# EAGLE design Decade Box Relay Board (EAGLE 6.5.0)
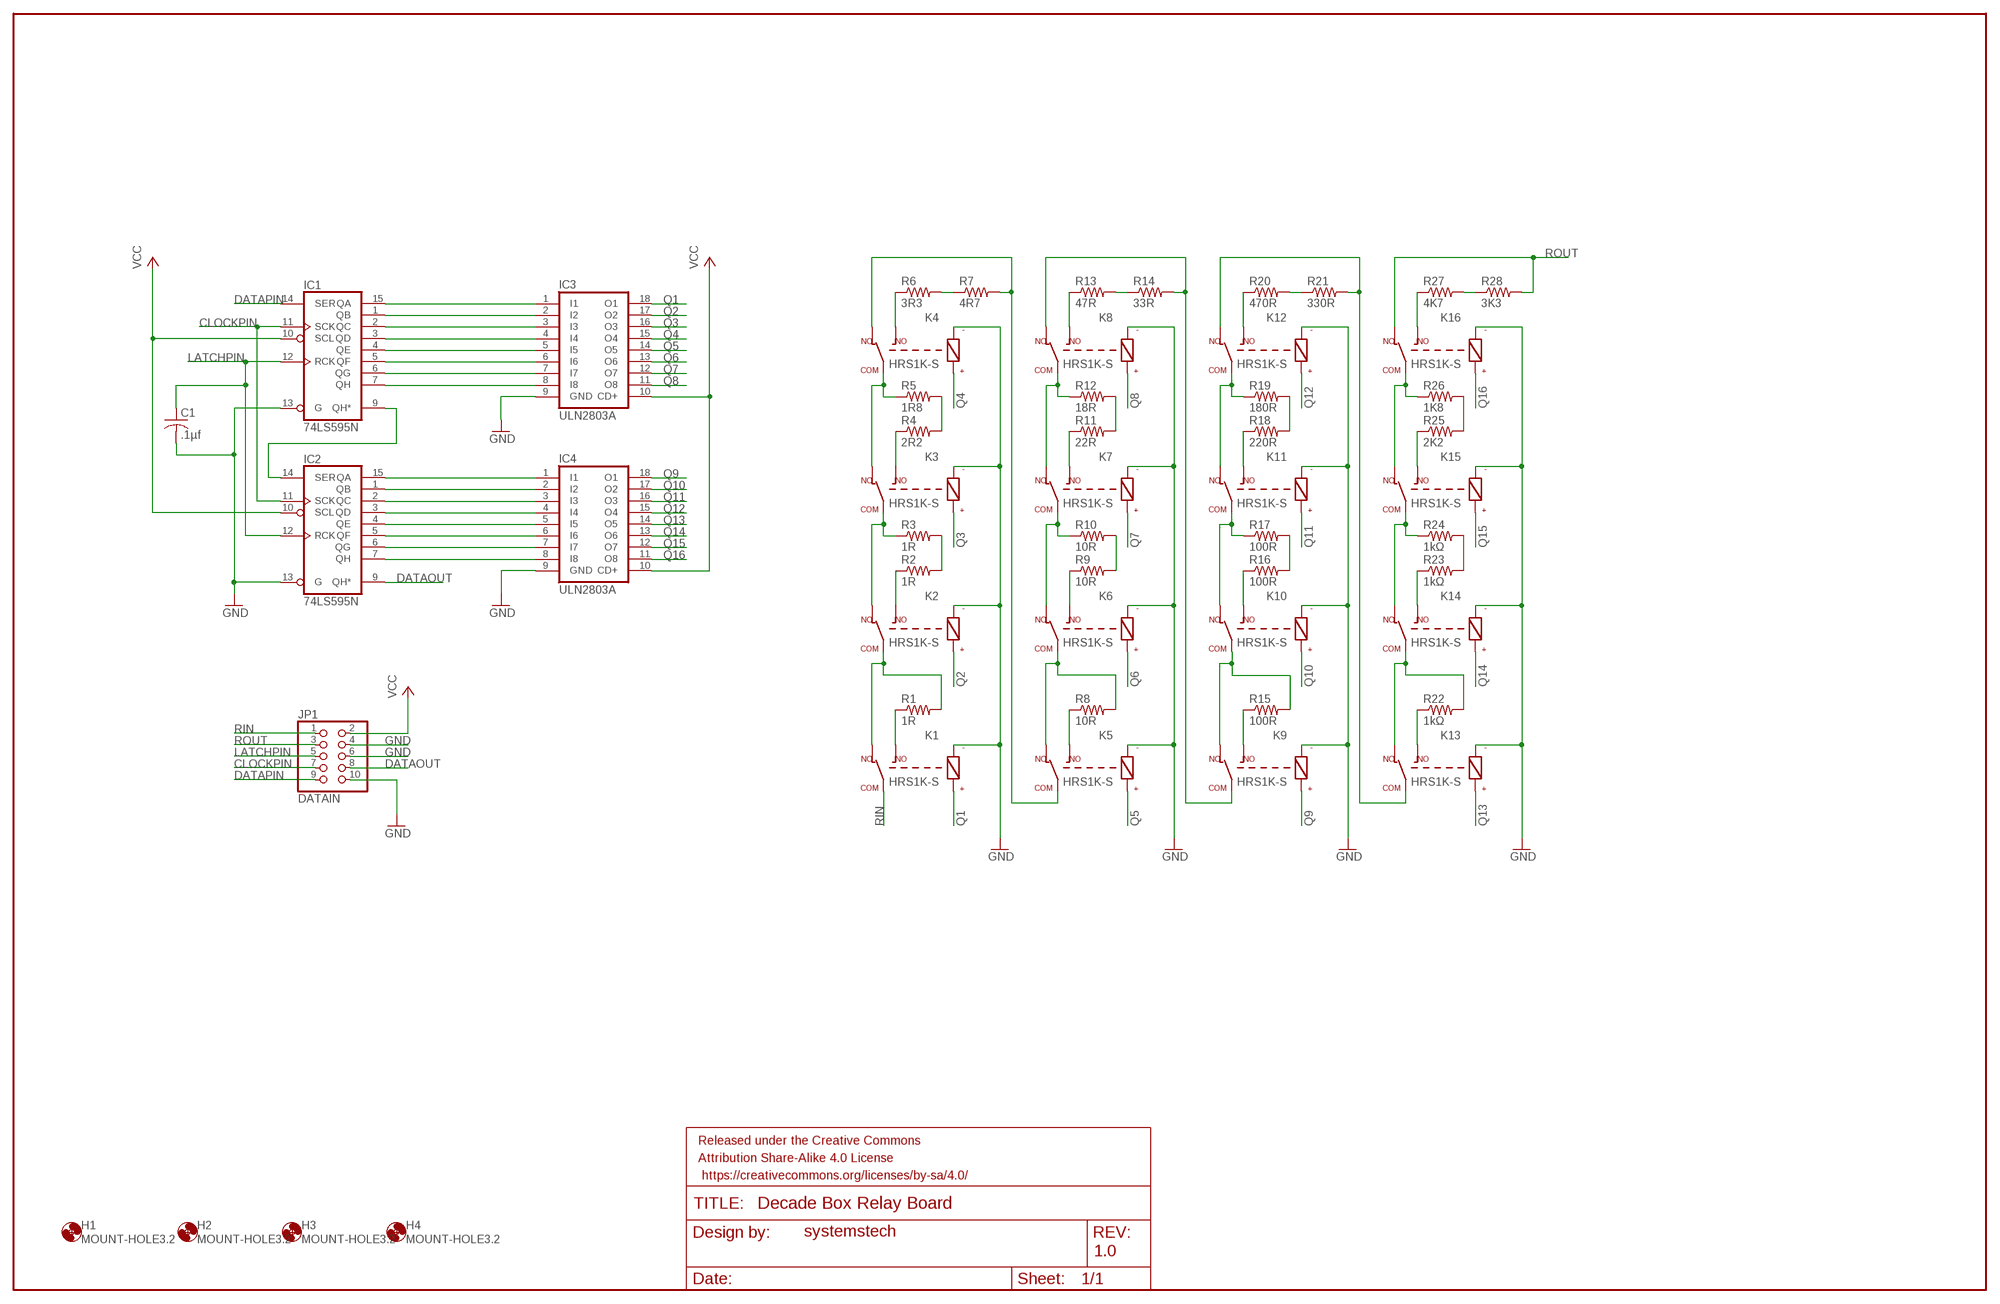
[diagram p0: schematic, sheet 1]

## Parts
C1  .1µf  C-US025-025X050  [C025-025X050]
FRAME1  FRAME-LEDGER  [CREATIVE_COMMONS]
H1  MOUNT-HOLE3.2  [3,2]
H2  MOUNT-HOLE3.2  [3,2]
H3  MOUNT-HOLE3.2  [3,2]
H4  MOUNT-HOLE3.2  [3,2]
IC1  74LS595N  [DIL16]
IC2  74LS595N  [DIL16]
IC3  ULN2803A  [DIL18]
IC4  ULN2803A  [DIL18]
JP1  DATAIN  PINHD-2X5  [2X05]
K1  HRS1K-S  [HRS1K-S]
K2  HRS1K-S  [HRS1K-S]
K3  HRS1K-S  [HRS1K-S]
K4  HRS1K-S  [HRS1K-S]
K5  HRS1K-S  [HRS1K-S]
K6  HRS1K-S  [HRS1K-S]
K7  HRS1K-S  [HRS1K-S]
K8  HRS1K-S  [HRS1K-S]
K9  HRS1K-S  [HRS1K-S]
K10  HRS1K-S  [HRS1K-S]
K11  HRS1K-S  [HRS1K-S]
K12  HRS1K-S  [HRS1K-S]
K13  HRS1K-S  [HRS1K-S]
K14  HRS1K-S  [HRS1K-S]
K15  HRS1K-S  [HRS1K-S]
K16  HRS1K-S  [HRS1K-S]
R1  1R  R-US_0411/15  [0411/15]
R2  1R  R-US_0411/15  [0411/15]
R3  1R  R-US_0411/15  [0411/15]
R4  2R2  R-US_0411/15  [0411/15]
R5  1R8  R-US_0411/15  [0411/15]
R6  3R3  R-US_0411/15  [0411/15]
R7  4R7  R-US_0411/15  [0411/15]
R8  10R  R-US_0411/15  [0411/15]
R9  10R  R-US_0411/15  [0411/15]
R10  10R  R-US_0411/15  [0411/15]
R11  22R  R-US_0411/15  [0411/15]
R12  18R  R-US_0411/15  [0411/15]
R13  47R  R-US_0411/15  [0411/15]
R14  33R  R-US_0411/15  [0411/15]
R15  100R  R-US_0411/15  [0411/15]
R16  100R  R-US_0411/15  [0411/15]
R17  100R  R-US_0411/15  [0411/15]
R18  220R  R-US_0411/15  [0411/15]
R19  180R  R-US_0411/15  [0411/15]
R20  470R  R-US_0411/15  [0411/15]
R21  330R  R-US_0411/15  [0411/15]
R22  1kΩ  R-US_0411/15  [0411/15]
R23  1kΩ  R-US_0411/15  [0411/15]
R24  1kΩ  R-US_0411/15  [0411/15]
R25  2K2  R-US_0411/15  [0411/15]
R26  1K8  R-US_0411/15  [0411/15]
R27  4K7  R-US_0411/15  [0411/15]
R28  3K3  R-US_0411/15  [0411/15]

## Nets
CLOCKPIN: IC1.11(SCK) IC2.11(SCK) JP1.7
DATAOUT: IC2.9(QH*) JP1.8
DATAPIN: IC1.14(SER) JP1.9
GND: C1.2 IC1.13(G) IC2.13(G) IC3.9(GND) IC4.9(GND) JP1.4 JP1.6 JP1.10 K1.P$3 K2.P$3 K3.P$3 K4.P$3 K5.P$3 K6.P$3 K7.P$3 K8.P$3 K9.P$3 K10.P$3 K11.P$3 K12.P$3 K13.P$3 K14.P$3 K15.P$3 K16.P$3
LATCHPIN: C1.1 IC1.12(RCK) IC2.12(RCK) JP1.5
N$1: K12.P$5 K13.P$1 R21.2
N$2: K7.P$4 R11.1
N$3: K15.P$5 K16.P$1 R26.1
N$4: K1.P$5 K2.P$1 R1.2
N$5: K10.P$5 K11.P$1 R17.1
N$6: R9.2 R10.2
N$7: K8.P$5 K9.P$1 R14.2
N$8: K4.P$4 R6.1
N$9: K4.P$5 K5.P$1 R7.2
N$10: R4.2 R5.2
N$11: K1.P$4 R1.1
N$12: IC1.9(QH*) IC2.14(SER)
N$13: K2.P$5 K3.P$1 R3.1
N$14: K2.P$4 R2.1
N$15: K11.P$5 K12.P$1 R19.1
N$16: K3.P$5 K4.P$1 R5.1
N$17: R2.2 R3.2
N$18: R11.2 R12.2
N$19: K5.P$5 K6.P$1 R8.2
N$20: K3.P$4 R4.1
N$21: IC1.15(QA) IC3.1(I1)
N$22: K6.P$5 K7.P$1 R10.1
N$23: R6.2 R7.1
N$24: K9.P$5 K10.P$1 R15.2
N$25: K7.P$5 K8.P$1 R12.1
N$26: K5.P$4 R8.1
N$27: IC1.1(QB) IC3.2(I2)
N$28: K13.P$5 K14.P$1 R22.2
N$29: K6.P$4 R9.1
N$30: K8.P$4 R13.1
N$31: K14.P$5 K15.P$1 R24.1
N$33: IC1.2(QC) IC3.3(I3)
N$34: K9.P$4 R15.1
N$35: IC1.3(QD) IC3.4(I4)
N$36: IC1.4(QE) IC3.5(I5)
N$37: IC1.5(QF) IC3.6(I6)
N$38: IC1.6(QG) IC3.7(I7)
N$39: IC1.7(QH) IC3.8(I8)
N$40: IC2.15(QA) IC4.1(I1)
N$41: IC2.1(QB) IC4.2(I2)
N$42: IC2.2(QC) IC4.3(I3)
N$43: IC2.3(QD) IC4.4(I4)
N$44: IC2.4(QE) IC4.5(I5)
N$45: IC2.5(QF) IC4.6(I6)
N$46: IC2.6(QG) IC4.7(I7)
N$47: IC2.7(QH) IC4.8(I8)
N$53: R13.2 R14.1
N$56: K10.P$4 R16.1
N$57: R16.2 R17.2
N$58: K11.P$4 R18.1
N$59: R18.2 R19.2
N$60: K12.P$4 R20.1
N$61: R20.2 R21.1
N$62: K13.P$4 R22.1
N$64: K14.P$4 R23.1
N$65: R23.2 R24.2
N$66: K15.P$4 R25.1
N$67: R25.2 R26.2
N$68: K16.P$4 R27.1
N$69: R27.2 R28.1
Q1: IC3.18(O1) K1.P$2
Q2: IC3.17(O2) K2.P$2
Q3: IC3.16(O3) K3.P$2
Q4: IC3.15(O4) K4.P$2
Q5: IC3.14(O5) K5.P$2
Q6: IC3.13(O6) K6.P$2
Q7: IC3.12(O7) K7.P$2
Q8: IC3.11(O8) K8.P$2
Q9: IC4.18(O1) K9.P$2
Q10: IC4.17(O2) K10.P$2
Q11: IC4.16(O3) K11.P$2
Q12: IC4.15(O4) K12.P$2
Q13: IC4.14(O5) K13.P$2
Q14: IC4.13(O6) K14.P$2
Q15: IC4.12(O7) K15.P$2
Q16: IC4.11(O8) K16.P$2
RIN: JP1.1 K1.P$1
ROUT: JP1.3 K16.P$5 R28.2
VCC: IC1.10(SCL) IC2.10(SCL) IC3.10(CD+) IC4.10(CD+) JP1.2

## Notes on the sheet
- systemstech
- 1.0

## Power pins joined to a net without a drawn wire
GND: IC1.8(GND) IC2.8(GND)
VCC: IC1.16(VCC) IC2.16(VCC)

## Library data of the parts
C1 = adafruit:C-US: CAPACITOR, American symbol
FRAME1 = SparkFun-Aesthetics:FRAME-LEDGER: Schematic Frame Standard 11x14 US Ledger frame
H1-H4 = holes:MOUNT-HOLE: MOUNTING HOLE with drill center marker
IC1 IC2 = 74xx-us:74*595: 8-bit SHIFT REGISTER, output latch
IC3 IC4 = uln-udn:ULN2803A: DRIVER ARRAY
JP1 = pinhead:PINHD-2X5: PIN HEADER
K1-K16 = railman:HRS1K-S
R1-R28 = adafruit:R-US_: RESISTOR, American symbol

## Board
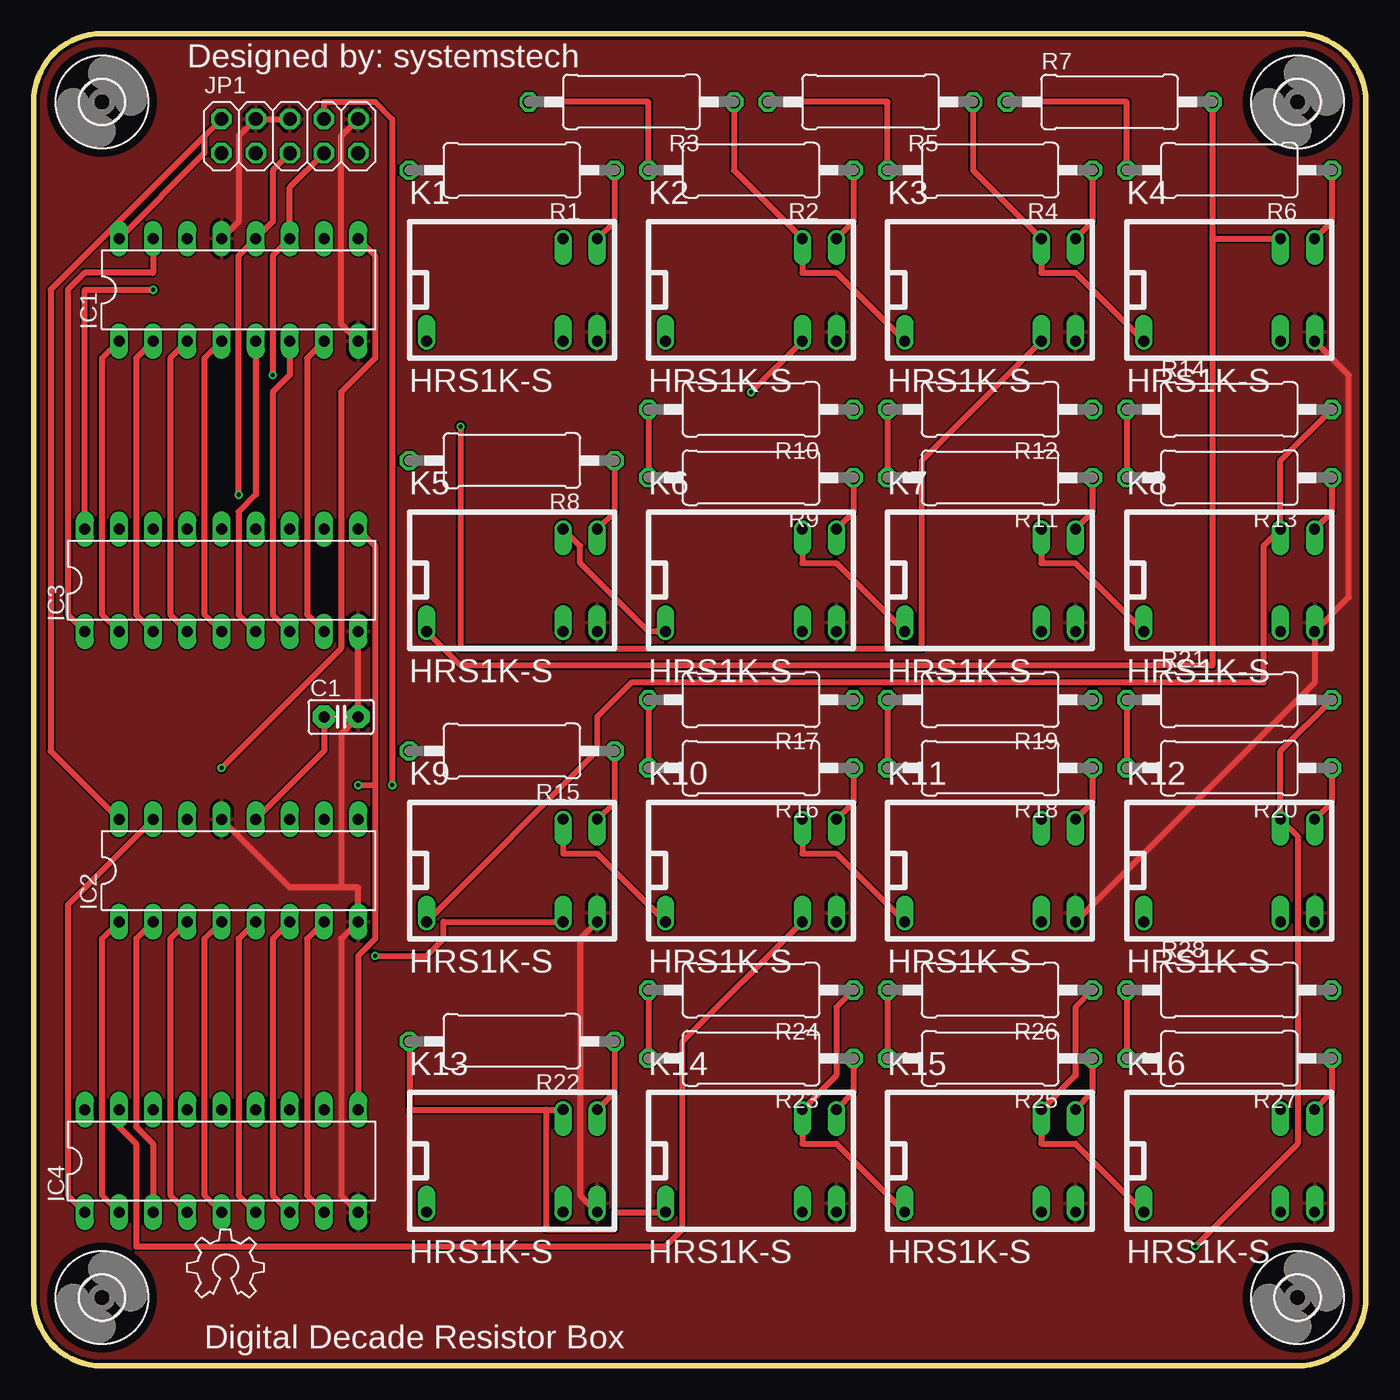
[diagram p1: board, top side]
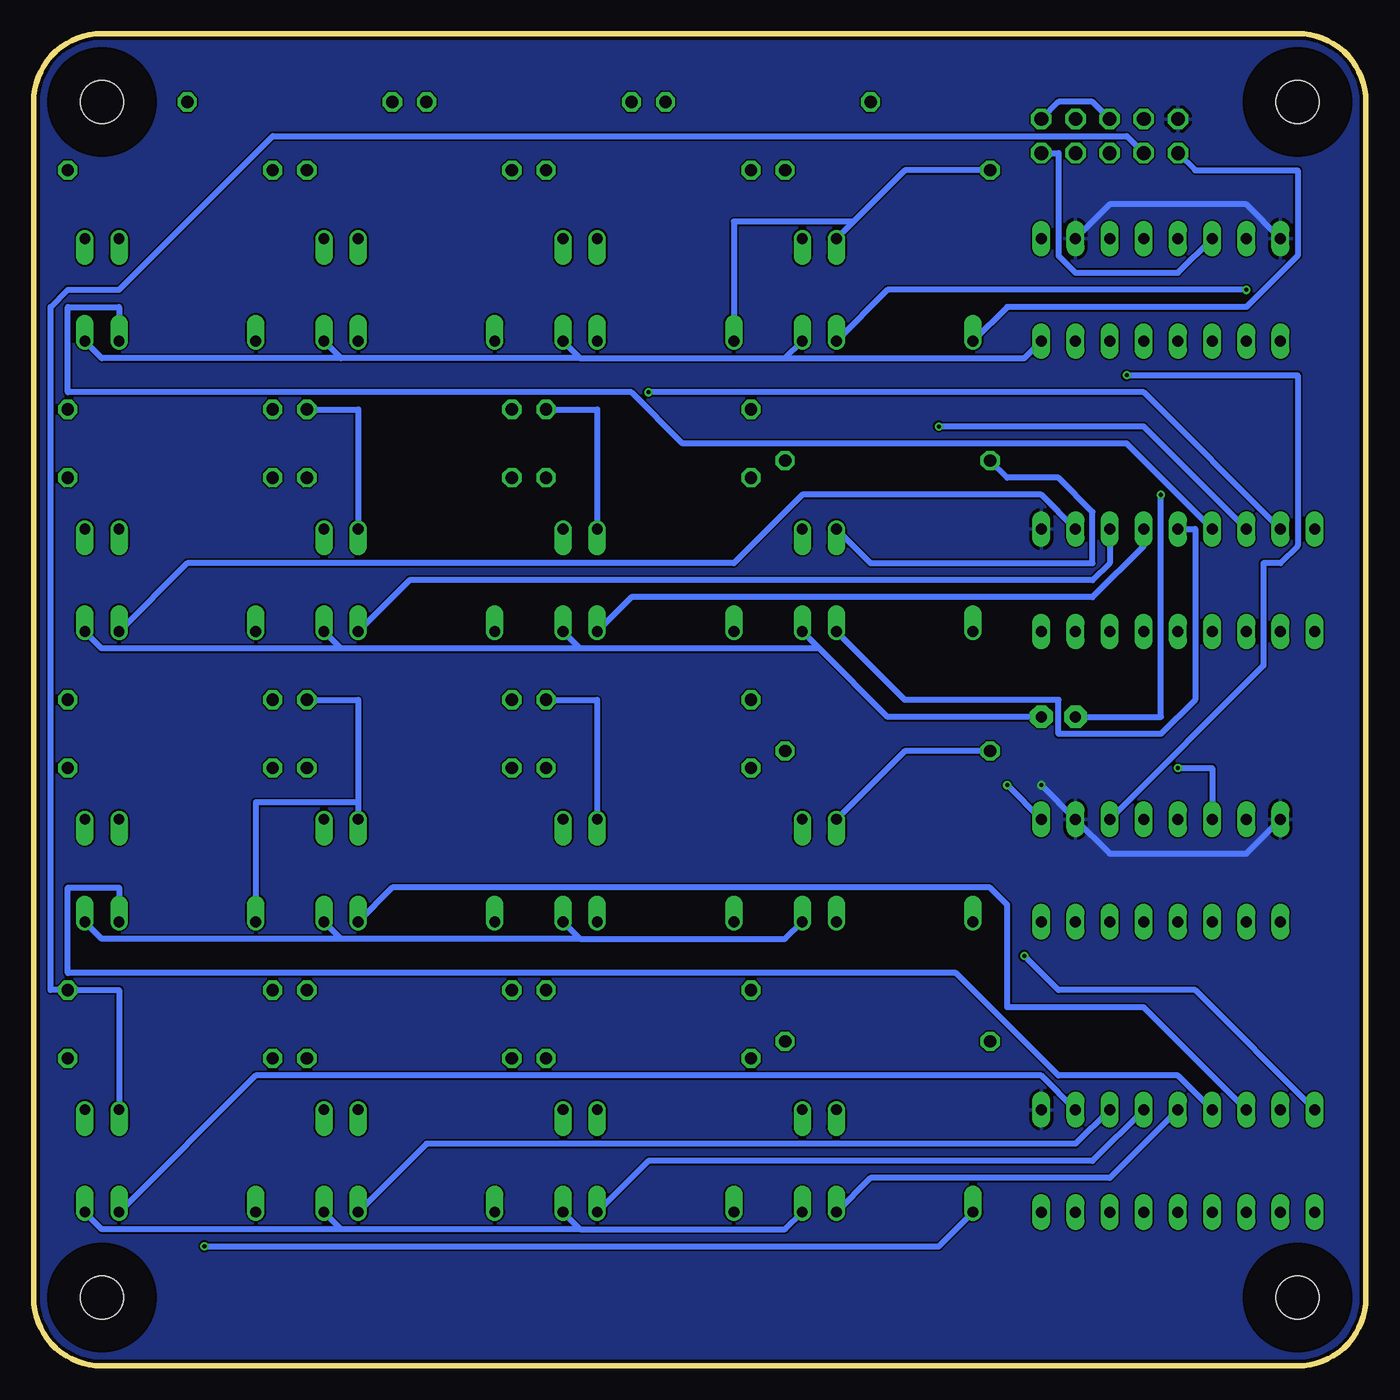
[diagram p2: board, bottom side, seen from below]

Size 99.06 x 99.06 mm. Coordinates in mm from the lower left corner, seen from the top.
Outline: 5.08,0 arc-90 0,5.08 0,93.98 arc-90 5.08,99.06 93.98,99.06 arc-90 99.06,93.98 99.06,5.08 arc-90 93.98,0 5.08,0
Copper layers (1*16): Top 0.035mm / dielectric 1.5mm / Bottom 0.035mm
Design rules "dirt_cheap_dirty_boards.v1 *": minimum track width 18mil, minimum drill 12mil, track to track 5mil, track to pad 5mil, pad to pad 5mil, via to via 5mil, smd to smd 0mil, copper to edge 10mil, drill to drill 10mil, minimum pad ring 10mil, minimum via ring 6mil, stop-mask expansion 2mil, vias tented up to drill 25mil, thermal gap 10mil

### Footprints (pad centres in the part's own frame; a part is rotated, then mirrored left to right if it is on the bottom)
C025-025X050 = drill 0.813 pad 1.676 octagon: 1 -1.27,0; 2 1.27,0
3,2 = hole 3.2: 0,0
DIL16 = drill 0.813 long: 1 -8.89,-3.81; 2 -6.35,-3.81; 3 -3.81,-3.81; 4 -1.27,-3.81; 5 1.27,-3.81; 6 3.81,-3.81; 7 6.35,-3.81; 8 8.89,-3.81; 9 8.89,3.81; 10 6.35,3.81; 11 3.81,3.81; 12 1.27,3.81; 13 -1.27,3.81; 14 -3.81,3.81; 15 -6.35,3.81; 16 -8.89,3.81
DIL18 = drill 0.813 long: 1 -10.16,-3.81; 2 -7.62,-3.81; 3 -5.08,-3.81; 4 -2.54,-3.81; 5 0,-3.81; 6 2.54,-3.81; 7 5.08,-3.81; 8 7.62,-3.81; 9 10.16,-3.81; 10 10.16,3.81; 11 7.62,3.81; 12 5.08,3.81; 13 2.54,3.81; 14 0,3.81; 15 -2.54,3.81; 16 -5.08,3.81; 17 -7.62,3.81; 18 -10.16,3.81
2X05 = drill 1.016 octagon: 1 -5.08,-1.27; 2 -5.08,1.27; 3 -2.54,-1.27; 4 -2.54,1.27; 5 0,-1.27; 6 0,1.27; 7 2.54,-1.27; 8 2.54,1.27; 9 5.08,-1.27; 10 5.08,1.27
HRS1K-S = drill 0.8 offset: P$1 -6.35,-3.81; P$2 3.81,-3.81; P$3 6.35,-3.81; P$4 6.35,3.81; P$5 3.81,3.81
0411/15 = drill 0.914 octagon: 1 -7.62,0; 2 7.62,0

### Placement (x,y rotation side)
C1  22.86,48.26 0 top
FRAME1  25.4,-11.43 0 top  (outside the outline)
H1  5.08,5.08 0 top
H2  5.08,93.98 0 top
H3  93.98,93.98 0 top
H4  93.98,5.08 0 top
IC1  15.24,80.01 0 top
IC2  15.24,36.83 0 top
IC3  13.97,58.42 0 top
IC4  13.97,15.24 0 top
JP1  19.05,91.44 0 top
K1  35.56,80.01 0 top
K2  53.34,80.01 0 top
K3  71.12,80.01 0 top
K4  88.9,80.01 0 top
K5  35.56,58.42 0 top
K6  53.34,58.42 0 top
K7  71.12,58.42 0 top
K8  88.9,58.42 0 top
K9  35.56,36.83 0 top
K10  53.34,36.83 0 top
K11  71.12,36.83 0 top
K12  88.9,36.83 0 top
K13  35.56,15.24 0 top
K14  53.34,15.24 0 top
K15  71.12,15.24 0 top
K16  88.9,15.24 0 top
R1  35.56,88.9 180 top
R2  53.34,88.9 180 top
R3  44.45,93.98 180 top
R4  71.12,88.9 180 top
R5  62.23,93.98 180 top
R6  88.9,88.9 180 top
R7  80.01,93.98 0 top
R8  35.56,67.31 180 top
R9  53.34,66.04 180 top
R10  53.34,71.12 180 top
R11  71.12,66.04 180 top
R12  71.12,71.12 180 top
R13  88.9,66.04 180 top
R14  88.9,71.12 0 top
R15  35.56,45.72 180 top
R16  53.34,44.45 180 top
R17  53.34,49.53 180 top
R18  71.12,44.45 180 top
R19  71.12,49.53 180 top
R20  88.9,44.45 180 top
R21  88.9,49.53 0 top
R22  35.56,24.13 180 top
R23  53.34,22.86 180 top
R24  53.34,27.94 180 top
R25  71.12,22.86 180 top
R26  71.12,27.94 180 top
R27  88.9,22.86 180 top
R28  88.9,27.94 0 top
U$10  [OSHW_6X200_NOTEXT]  11.43,5.08 0 top

### Tracks (layer width: path | path; a pad name or v marks a point on that pad's centre or on a via)
CLOCKPIN  (via drill 0.3)
  Top 0.457: v17.78,73.66 17.78,82.55 IC1.11 19.05,87.63 JP1.7
  Bottom 0.457: IC2.11 7.62,52.07 7.62,59.69 6.35,59.69 5.08,60.96 5.08,73.66 v17.78,73.66
DATAOUT  (via drill 0.3)
  Top 0.457: v26.67,43.18 26.67,92.71 25.4,93.98 21.59,93.98 JP1.8
  Bottom 0.457: v26.67,43.18 IC2.9
DATAPIN
  Bottom 0.457: IC1.14 13.97,81.28 21.59,81.28 22.86,82.55 22.86,90.17 JP1.9
GND
  Top 0.457: IC1.13 15.24,85.09 15.24,91.44 JP1.4 JP1.6 | JP1.10 22.86,91.44 22.86,77.47 IC1.8 | K13.P$3 40.64,12.7 40.64,31.75 K9.P$3 | IC4.9 22.86,12.7 22.86,31.75 IC2.8 24.13,35.56 22.86,35.56 | IC2.13 19.05,35.56 22.86,35.56 | IC3.9 C1.2 22.86,46.99 22.86,35.56 | K11.P$3 95.25,50.8 K8.P$3 97.79,57.15 97.79,73.66 K4.P$3
  Bottom 0.457: JP1.10 22.86,93.98 20.32,93.98 JP1.6 | 43.18,74.93 K1.P$3 | 58.42,74.93 43.18,74.93 | K2.P$3 58.42,74.93 | 76.2,74.93 K3.P$3 | 58.42,74.93 76.2,74.93 | K4.P$3 93.98,74.93 76.2,74.93 | IC1.8 25.4,74.93 43.18,74.93 | K13.P$3 43.18,10.16 58.42,10.16 | K14.P$3 58.42,10.16 | 76.2,10.16 K15.P$3 | 58.42,10.16 76.2,10.16 | K16.P$3 93.98,10.16 76.2,10.16 | K9.P$3 43.18,31.75 58.42,31.75 | K10.P$3 58.42,31.75 | 76.2,31.75 K11.P$3 | 58.42,31.75 76.2,31.75 | K12.P$3 93.98,31.75 76.2,31.75 | 40.64,53.34 35.56,48.26 C1.2 | 40.64,53.34 K5.P$3 | 58.42,53.34 K6.P$3 | 40.64,53.34 58.42,53.34 | 76.2,53.34 K7.P$3 | 58.42,53.34 76.2,53.34 | K8.P$3 93.98,53.34 76.2,53.34
  pour Bottom: 99.06,93.98 arc90 93.98,99.06
  pour Top: 5.08,0 arc-90 0,5.08 0,93.98 arc-90 5.08,99.06 93.98,99.06 arc-90 99.06,93.98 99.06,3.81 arc-90 95.25,0
LATCHPIN  (via drill 0.3)
  Top 0.457: JP1.5 17.78,88.9 17.78,85.09 IC1.12 15.24,82.55 v15.24,64.77 | IC2.12 21.59,45.72 C1.1
  Bottom 0.457: v15.24,64.77 15.24,48.26 C1.1
N$1  (via drill 0.3)
  Top 0.457: v86.36,8.89 93.98,16.51 93.98,39.37 K12.P$5 92.71,45.72 R21.2
  Bottom 0.457: K13.P$1 31.75,8.89 v86.36,8.89
N$2
  Top 0.457: K7.P$4 78.74,63.5 R11.1
N$3
  Top 0.457: R26.1 77.47,26.67 77.47,21.59 K15.P$5 74.93,16.51 77.47,16.51 K16.P$1
N$4
  Bottom 0.457: 38.1,85.09 34.29,88.9 R1.2 | 38.1,85.09 K1.P$5 | K2.P$1 46.99,85.09 38.1,85.09
N$5
  Top 0.457: K11.P$1 59.69,38.1 57.15,38.1 K10.P$5
  Bottom 0.457: K10.P$5 57.15,49.53 R17.1
N$6
  Top 0.457: R10.2 R9.2
N$7
  Top 0.457: K9.P$1 41.91,45.72 41.91,48.26 44.45,50.8 91.44,50.8 91.44,60.96 K8.P$5 92.71,67.31 R14.2
N$8
  Top 0.457: K4.P$4 96.52,85.09 R6.1
N$9
  Top 0.457: K5.P$1 31.75,52.07 87.63,52.07 87.63,83.82 | R7.2 87.63,83.82 | 87.63,83.82 K4.P$5
N$10
  Top 0.457: R5.2 63.5,93.98 R4.2
N$11
  Top 0.457: K1.P$4 43.18,85.09 R1.1
N$12  (via drill 0.3)
  Top 0.457: v13.97,44.45 22.86,53.34 22.86,72.39 25.4,74.93 25.4,82.55 IC1.9
  Bottom 0.457: IC2.14 11.43,44.45 v13.97,44.45
N$13
  Top 0.457: R3.1 52.07,88.9 K2.P$5 57.15,81.28 59.69,81.28 K3.P$1
N$14
  Top 0.457: K2.P$4 60.96,85.09 R2.1
N$15
  Bottom 0.457: 74.93,41.91 74.93,49.53 R19.1 | 74.93,41.91 K11.P$5 | K12.P$1 82.55,41.91 74.93,41.91
N$16
  Top 0.457: R5.1 69.85,88.9 K3.P$5 74.93,81.28 77.47,81.28 K4.P$1
N$17
  Top 0.457: R3.2 45.72,93.98 R2.2
N$18
  Top 0.457: R12.2 R11.2
N$19
  Top 0.457: K5.P$5 40.64,60.96 40.64,59.69 45.72,54.61 K6.P$1
  Bottom 0.457: R8.2 26.67,66.04 22.86,66.04 20.32,63.5 20.32,59.69 36.83,59.69 K5.P$5
N$20
  Top 0.457: K3.P$4 78.74,85.09 R4.1
N$21
  Top 0.457: IC3.1 2.54,55.88 2.54,80.01 3.81,81.28 8.89,81.28 IC1.15
N$22
  Top 0.457: K7.P$1 59.69,59.69 57.15,59.69 K6.P$5
  Bottom 0.457: K6.P$5 57.15,71.12 R10.1
N$23
  Top 0.457: R7.1 81.28,93.98 R6.2
N$24
  Top 0.457: K10.P$1 41.91,38.1 39.37,38.1 K9.P$5
  Bottom 0.457: K9.P$5 34.29,45.72 R15.2
N$25
  Top 0.457: K8.P$1 77.47,59.69 74.93,59.69 K7.P$5
  Bottom 0.457: K7.P$5 74.93,71.12 R12.1
N$26
  Top 0.457: K5.P$4 43.18,63.5 R8.1
N$27
  Top 0.457: IC3.2 5.08,55.88 5.08,74.93 IC1.1
N$28
  Top 0.457: 38.1,19.05 27.94,19.05 R22.2 | 38.1,19.05 K13.P$5 | K14.P$1 43.18,11.43 43.18,10.16 38.1,10.16 38.1,19.05
N$29
  Top 0.457: K6.P$4 60.96,63.5 R9.1
N$30
  Top 0.457: K8.P$4 96.52,63.5 R13.1
N$31
  Top 0.457: R24.1 59.69,26.67 59.69,21.59 K14.P$5 57.15,16.51 59.69,16.51 K15.P$1
N$33
  Top 0.457: IC3.3 7.62,55.88 7.62,74.93 IC1.2
N$34
  Top 0.457: K9.P$4 43.18,41.91 R15.1
N$35
  Top 0.457: IC3.4 10.16,55.88 10.16,74.93 IC1.3
N$36
  Top 0.457: IC3.5 12.7,55.88 12.7,74.93 IC1.4
N$37
  Top 0.457: IC3.6 15.24,55.88 15.24,63.5 16.51,64.77 IC1.5
N$38
  Top 0.457: IC3.7 17.78,55.88 17.78,72.39 19.05,73.66 IC1.6
N$39
  Top 0.457: IC3.8 20.32,55.88 20.32,74.93 IC1.7
N$40
  Top 0.457: IC4.1 2.54,12.7 2.54,34.29 IC2.15
N$41
  Top 0.457: IC4.2 5.08,12.7 5.08,31.75 IC2.1
N$42
  Top 0.457: IC4.3 8.89,16.51 7.62,17.78 7.62,31.75 IC2.2
N$43
  Top 0.457: IC4.4 10.16,12.7 10.16,31.75 IC2.3
N$44
  Top 0.457: IC4.5 12.7,12.7 12.7,31.75 IC2.4
N$45
  Top 0.457: IC4.6 15.24,12.7 15.24,31.75 IC2.5
N$46
  Top 0.457: IC4.7 17.78,12.7 17.78,31.75 IC2.6
N$47
  Top 0.457: IC4.8 20.32,12.7 20.32,31.75 IC2.7
N$53
  Top 0.457: R14.1 R13.2
N$56
  Top 0.457: K10.P$4 60.96,41.91 R16.1
N$57
  Top 0.457: R17.2 R16.2
N$58
  Top 0.457: K11.P$4 78.74,41.91 R18.1
N$59
  Top 0.457: R19.2 R18.2
N$60
  Top 0.457: K12.P$4 96.52,41.91 R20.1
N$61
  Top 0.457: R21.1 R20.2
N$62
  Top 0.457: K13.P$4 43.18,20.32 R22.1
N$64
  Top 0.457: K14.P$4 60.96,20.32 R23.1
N$65
  Top 0.457: R24.2 R23.2
N$66
  Top 0.457: K15.P$4 78.74,20.32 R25.1
N$67
  Top 0.457: R26.2 R25.2
N$68
  Top 0.457: K16.P$4 96.52,20.32 R27.1
N$69
  Top 0.457: R28.1 R27.2
Q1  (via drill 0.3)
  Top 0.457: v8.89,80.01 3.81,80.01 IC3.18
  Bottom 0.457: K1.P$2 35.56,80.01 v8.89,80.01
Q2  (via drill 0.3)
  Top 0.457: v53.34,72.39 K2.P$2
  Bottom 0.457: v53.34,72.39 16.51,72.39 IC3.17
Q3  (via drill 0.3)
  Top 0.457: K3.P$2 66.04,67.31 66.04,53.34 31.75,53.34 v31.75,69.85
  Bottom 0.457: v31.75,69.85 16.51,69.85 IC3.16
Q4
  Bottom 0.457: K4.P$2 92.71,78.74 96.52,78.74 96.52,72.39 54.61,72.39 50.8,68.58 17.78,68.58 IC3.15
Q5
  Bottom 0.457: K5.P$2 34.29,49.53 22.86,49.53 22.86,46.99 15.24,46.99 12.7,49.53 12.7,62.23 IC3.14
Q6
  Bottom 0.457: K6.P$2 54.61,57.15 20.32,57.15 16.51,60.96 IC3.13
Q7
  Bottom 0.457: K7.P$2 71.12,58.42 20.32,58.42 19.05,59.69 IC3.12
Q8
  Bottom 0.457: K8.P$2 87.63,59.69 46.99,59.69 41.91,64.77 24.13,64.77 IC3.11
Q9  (via drill 0.3)
  Top 0.457: K9.P$2 30.48,33.02 30.48,31.75 29.21,30.48 v25.4,30.48
  Bottom 0.457: v25.4,30.48 22.86,27.94 12.7,27.94 IC4.18
Q10
  Top 0.457: K10.P$2 48.26,24.13 48.26,10.16 46.99,8.89 7.62,8.89 7.62,16.51 6.35,17.78 IC4.17
Q11
  Bottom 0.457: K11.P$2 72.39,35.56 27.94,35.56 26.67,34.29 26.67,26.67 16.51,26.67 IC4.16
Q12
  Bottom 0.457: K12.P$2 92.71,35.56 96.52,35.56 96.52,29.21 30.48,29.21 22.86,21.59 13.97,21.59 IC4.15
Q13
  Bottom 0.457: K13.P$2 36.83,13.97 19.05,13.97 IC4.14
Q14
  Bottom 0.457: K14.P$2 53.34,15.24 20.32,15.24 IC4.13
Q15
  Bottom 0.457: K15.P$2 69.85,16.51 21.59,16.51 IC4.12
Q16
  Bottom 0.457: K16.P$2 82.55,21.59 24.13,21.59 IC4.11
RIN
  Bottom 0.457: K1.P$1 26.67,78.74 8.89,78.74 5.08,82.55 5.08,88.9 12.7,88.9 JP1.1
ROUT
  Bottom 0.457: K16.P$5 92.71,27.94 R28.2 97.79,27.94 97.79,78.74 96.52,80.01 92.71,80.01 81.28,91.44 17.78,91.44 JP1.3
VCC  (via drill 0.3)
  Top 0.457: IC4.10 24.13,30.48 25.4,31.75 25.4,43.18 | 25.4,43.18 25.4,60.96 IC3.10 | IC1.16 12.7,90.17 12.7,91.44 | JP1.2 12.7,91.44 | IC2.16 1.27,45.72 1.27,80.01 12.7,91.44 | v24.13,43.18 25.4,43.18
  Bottom 0.457: IC2.16 8.89,38.1 19.05,38.1 IC2.10 v24.13,43.18 | IC1.10 19.05,86.36 8.89,86.36 IC1.16
  pour Top: 0,5.08 arc90 5.08,0
  pour Bottom: 5.08,0 arc-90 0,5.08 0,93.98 arc-90 5.08,99.06 93.98,99.06 arc-90 99.06,93.98 99.06,3.81 arc-90 95.25,0

### Text on the board
Document: systemstech
_tsilk: Designed by: systemstech | Digital Decade Resistor Box